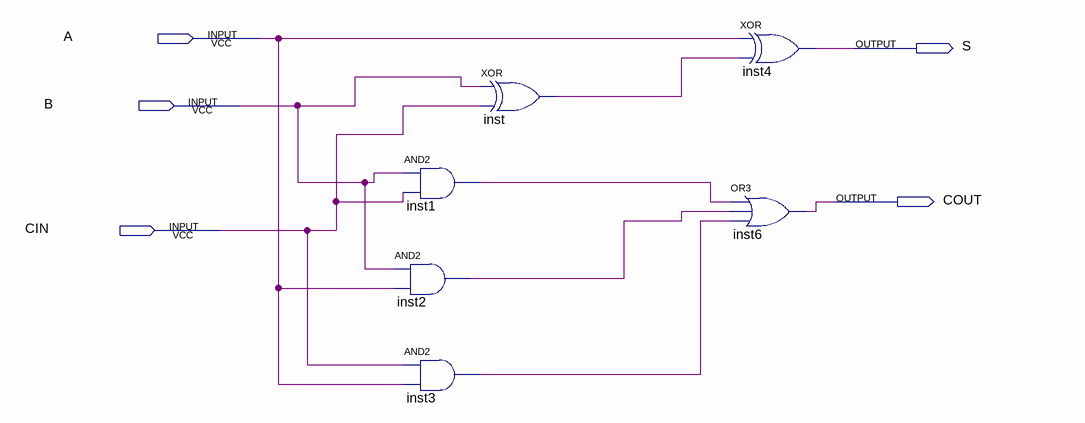
[diagram p0: schematic sheet]
// Quartus schematic somador1bit.bdf as structural Verilog: 6 symbols, 5 pins
module somador1bit (
  input  A,
  input  B,
  input  CIN,
  output S,
  output COUT
);

  wire inst1_out, inst2_out, inst3_out, inst_out;

  and inst1 (inst1_out, B, CIN);
  and inst2 (inst2_out, B, A);
  and inst3 (inst3_out, CIN, A);
  xor inst (inst_out, B, CIN);
  xor inst4 (S, A, inst_out);
  or inst6 (COUT, inst1_out, inst2_out, inst3_out);
endmodule
